# Altium schematic sheet Power Supply.SchDoc
size A3; SheetNumber: 2; SheetTotal: 6
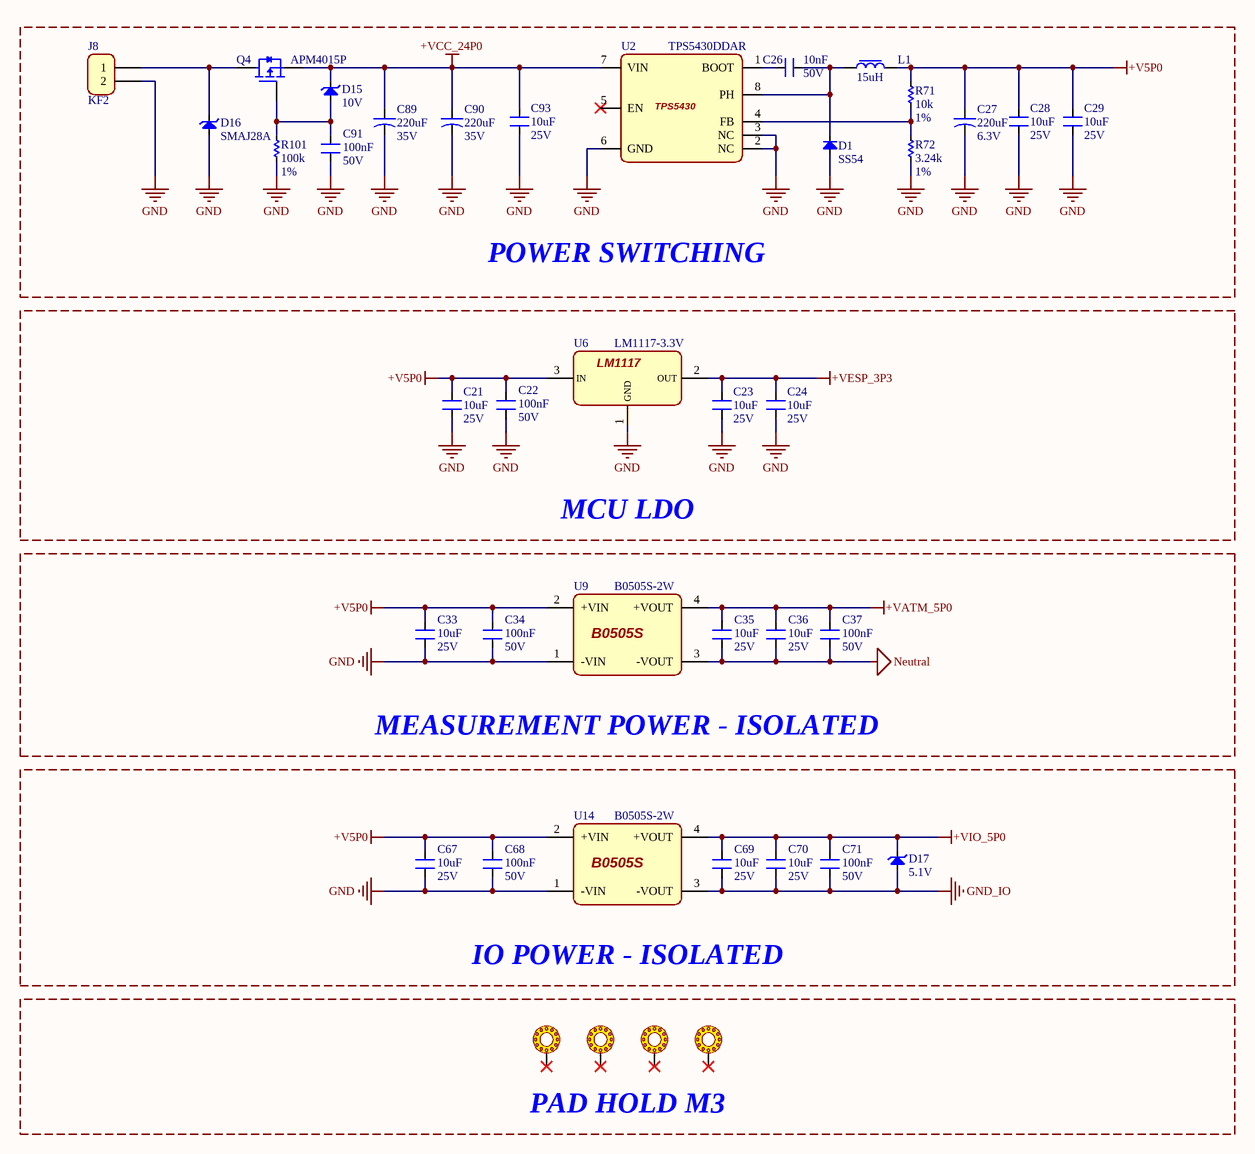
[diagram p0: Power Supply.SchDoc]

## Parts
C21  Rating: 25V  [CAP_SMD_1206]  (hidden comment: 10uF)
C22  Rating: 50V  [CAP_SMD_0603]  (hidden comment: 100nF)
C23  Rating: 25V  [CAP_SMD_1206]  (hidden comment: 10uF)
C24  Rating: 25V  [CAP_SMD_1206]  (hidden comment: 10uF)
C26  Rating: 50V  [CAP_SMD_0603]  (hidden comment: 10nF)
C27  Rating: 6.3V  [TANT 2312]  (hidden comment: 220uF)
C28  Rating: 25V  [CAP_SMD_1206]  (hidden comment: 10uF)
C29  Rating: 25V  [CAP_SMD_1206]  (hidden comment: 10uF)
C33  Rating: 25V  [CAP_SMD_0603]  (hidden comment: 10uF)
C34  Rating: 50V  [CAP_SMD_0603]  (hidden comment: 100nF)
C35  Rating: 25V  [CAP_SMD_0603]  (hidden comment: 10uF)
C36  Rating: 25V  [CAP_SMD_0603]  (hidden comment: 10uF)
C37  Rating: 50V  [CAP_SMD_0603]  (hidden comment: 100nF)
C67  Rating: 25V  [CAP_SMD_0603]  (hidden comment: 10uF)
C68  Rating: 50V  [CAP_SMD_0603]  (hidden comment: 100nF)
C69  Rating: 25V  [CAP_SMD_0603]  (hidden comment: 10uF)
C70  Rating: 25V  [CAP_SMD_0603]  (hidden comment: 10uF)
C71  Rating: 50V  [CAP_SMD_0603]  (hidden comment: 100nF)
C89  Rating: 35V  [TANT 2312]  (hidden comment: 220uF)
C90  Rating: 35V  [TANT 2312]  (hidden comment: 220uF)
C91  Rating: 50V  [CAP_SMD_0603]  (hidden comment: 100nF)
C93  Rating: 25V  [CAP_SMD_1206]  (hidden comment: 10uF)
D1  SS54  [DIO-SMD-A]
D15  10V  [DIO-0.5A-SMALL]
D16  SMAJ28A  [DIO-SMD-A]
D17  5.1V  [DIO-0.5A-SMALL]
H1  HOLD  [M3-VIA]  (value not drawn)
H2  HOLD  [M3-VIA]  (value not drawn)
H3  HOLD  [M3-VIA]  (value not drawn)
H4  HOLD  [M3-VIA]  (value not drawn)
J8  KF2  [KF2-5.08X]
L1  15uH  [SRP7030]
Q4  APM4015P  [TO252-123]
R71  Tolerance: 1%  [RES_SMD_0603]  (hidden comment: 10k)
R72  Tolerance: 1%  [RES_SMD_0603]  (hidden comment: 3.24k)
R101  Tolerance: 1%  [RES_SMD_0603]  (hidden comment: 100k)
U2  TPS5430DDAR  [SOIC-8-EP]
U6  LM1117-3.3V  [SOT223-4]
U9  B0505S-2W  [SIP,19.6x7mm]
U14  B0505S-2W  [SIP,19.6x7mm]

## Blocks framed on the sheet
POWER SWITCHING: C26-C29 C89-C91 C93 D1 D15 D16 J8 L1 Q4 R71 R72 R101 U2
MCU LDO: C21-C24 U6
MEASUREMENT POWER - ISOLATED: C33-C37 U9
IO POWER - ISOLATED: C67-C71 D17 U14
PAD HOLD M3: H1-H4

## Nets
+V5P0: C21.1 C22.2 C27.1 C28.1 C29.1 C33.2 C34.2 C67.2 C68.2 L1.2 R71.2 U6.3(IN) U9.2(+VIN) U14.2(+VIN)
+VATM_5P0: C35.2 C36.2 C37.2 U9.4(+VOUT)
+VCC_24P0: C89.1 C90.1 C93.1 D15.2(K) Q4.2 U2.7(VIN)
+VESP_3P3: C23.1 C24.1 U6.2(OUT)
+VIO_5P0: C69.2 C70.2 C71.2 D17.2(K) U14.4(+VOUT)
GND: C21.2 C22.1 C23.2 C24.2 C27.2 C28.2 C29.2 C33.1 C34.1 C67.1 C68.1 C89.2 C90.2 C91.1 C93.2 D1.1(A) D16.1(A) J8.2 R72.1 R101.1 U2.2(NC) U2.3(NC) U2.6(GND) U6.1(GND) U9.1(-VIN) U14.1(-VIN)
GND_IO: C69.1 C70.1 C71.1 D17.1(A) U14.3(-VOUT)
Neutral: C35.1 C36.1 C37.1 U9.3(-VOUT)
NetC26_1: C26.1 D1.2(K) L1.1 U2.8(PH)
NetC26_2: C26.2 U2.1(BOOT)
NetC91_2: C91.2 D15.1(A) Q4.1 R101.2
NetD16_2: D16.2(K) J8.1 Q4.3
NetR71_1: R71.1 R72.2 U2.4(FB)

Not connected (* = marked no-connect by the designer): H1 1*; H2 1*; H3 1*; H4 1*; U2 5(EN)*

## Library data of the parts
C21-C24 C26 C28 C29 C33-C37 C67-C71 C91 C93 = CN: PN: *; LCSC: *
  C21 C23 C24 C28 C29 C33 C35 C36 C67 C69 C70 C93: Value: 10uF
  C22 C34 C37 C68 C71 C91: Value: 100nF
  C26: Value: 10nF
C27 C89 C90 = CN-TANTALUM: LCSC: *; PN: *; Value: 220uF
D1 = Diode SMD: Default Diode; LCSC: C22452; PN: SS54; Value: SS54
D15 D17 = DIODE Zener: Zenner; PN: *; LCSC: *
  D15: Value: 10V
  D17: Value: 5.1V
D16 = TVS DIODE: PN: *; LCSC: *; Value: SMAJ28A
H1-H4 = PAD_HOLD
J8 = KF2: ComponentLink1 Description: Manufacturer; ComponentLink2 Description: Datasheet; Manufacturer: *; ComponentLink1URL: http://www.we-online.com; ComponentLink2URL: http://katalog.we-online.de/em/datasheet/6911031100xx.pdf; LCSC: *; PN: *; Value: KF2
L1 = INDUCTOR: PN: MDA7030-150M; LCSC: C2847486; Value: 15uH
Q4 = FET-P: PN: *; LCSC: *; Value: APM4015P
R71 R72 R101 = Res-SMD: Resistor; PN: *; LCSC: *
  R71: Value: 10k
  R72: Value: 3.24k
  R101: Value: 100k
U2 = TPS5430: -40℃~+125℃@(TJ) 1 1.221V~32.04V 3A 4.4mA 5.5V~36V 500kHz Adjustable Buck Buck Built-in No SOIC-8-EP DC-DC Converters ROHS; LCSC: C9864; PN: TPS5430DDAR; Value: TPS5430DDAR
U6 = LM1117: 800mA Low-Dropout Linear Regulator; PN: LM1117MPX-3.3/NOPB; LCSC: C9662; Value: LM1117-3.3V
U9 U14 = B0505S: -40℃~+85℃ 1 1.5kV 100kHz 2W 4.5V~5.5V 400mA 5V 75mVp-p 84% Short Circuit Protection SIP,19.6x7mm Isolated Power Modules ROHS; LCSC: C387593; PN: B0505S-2W; Value: B0505S-2W